# EAGLE schematic untitled (EAGLE 9.0.1)
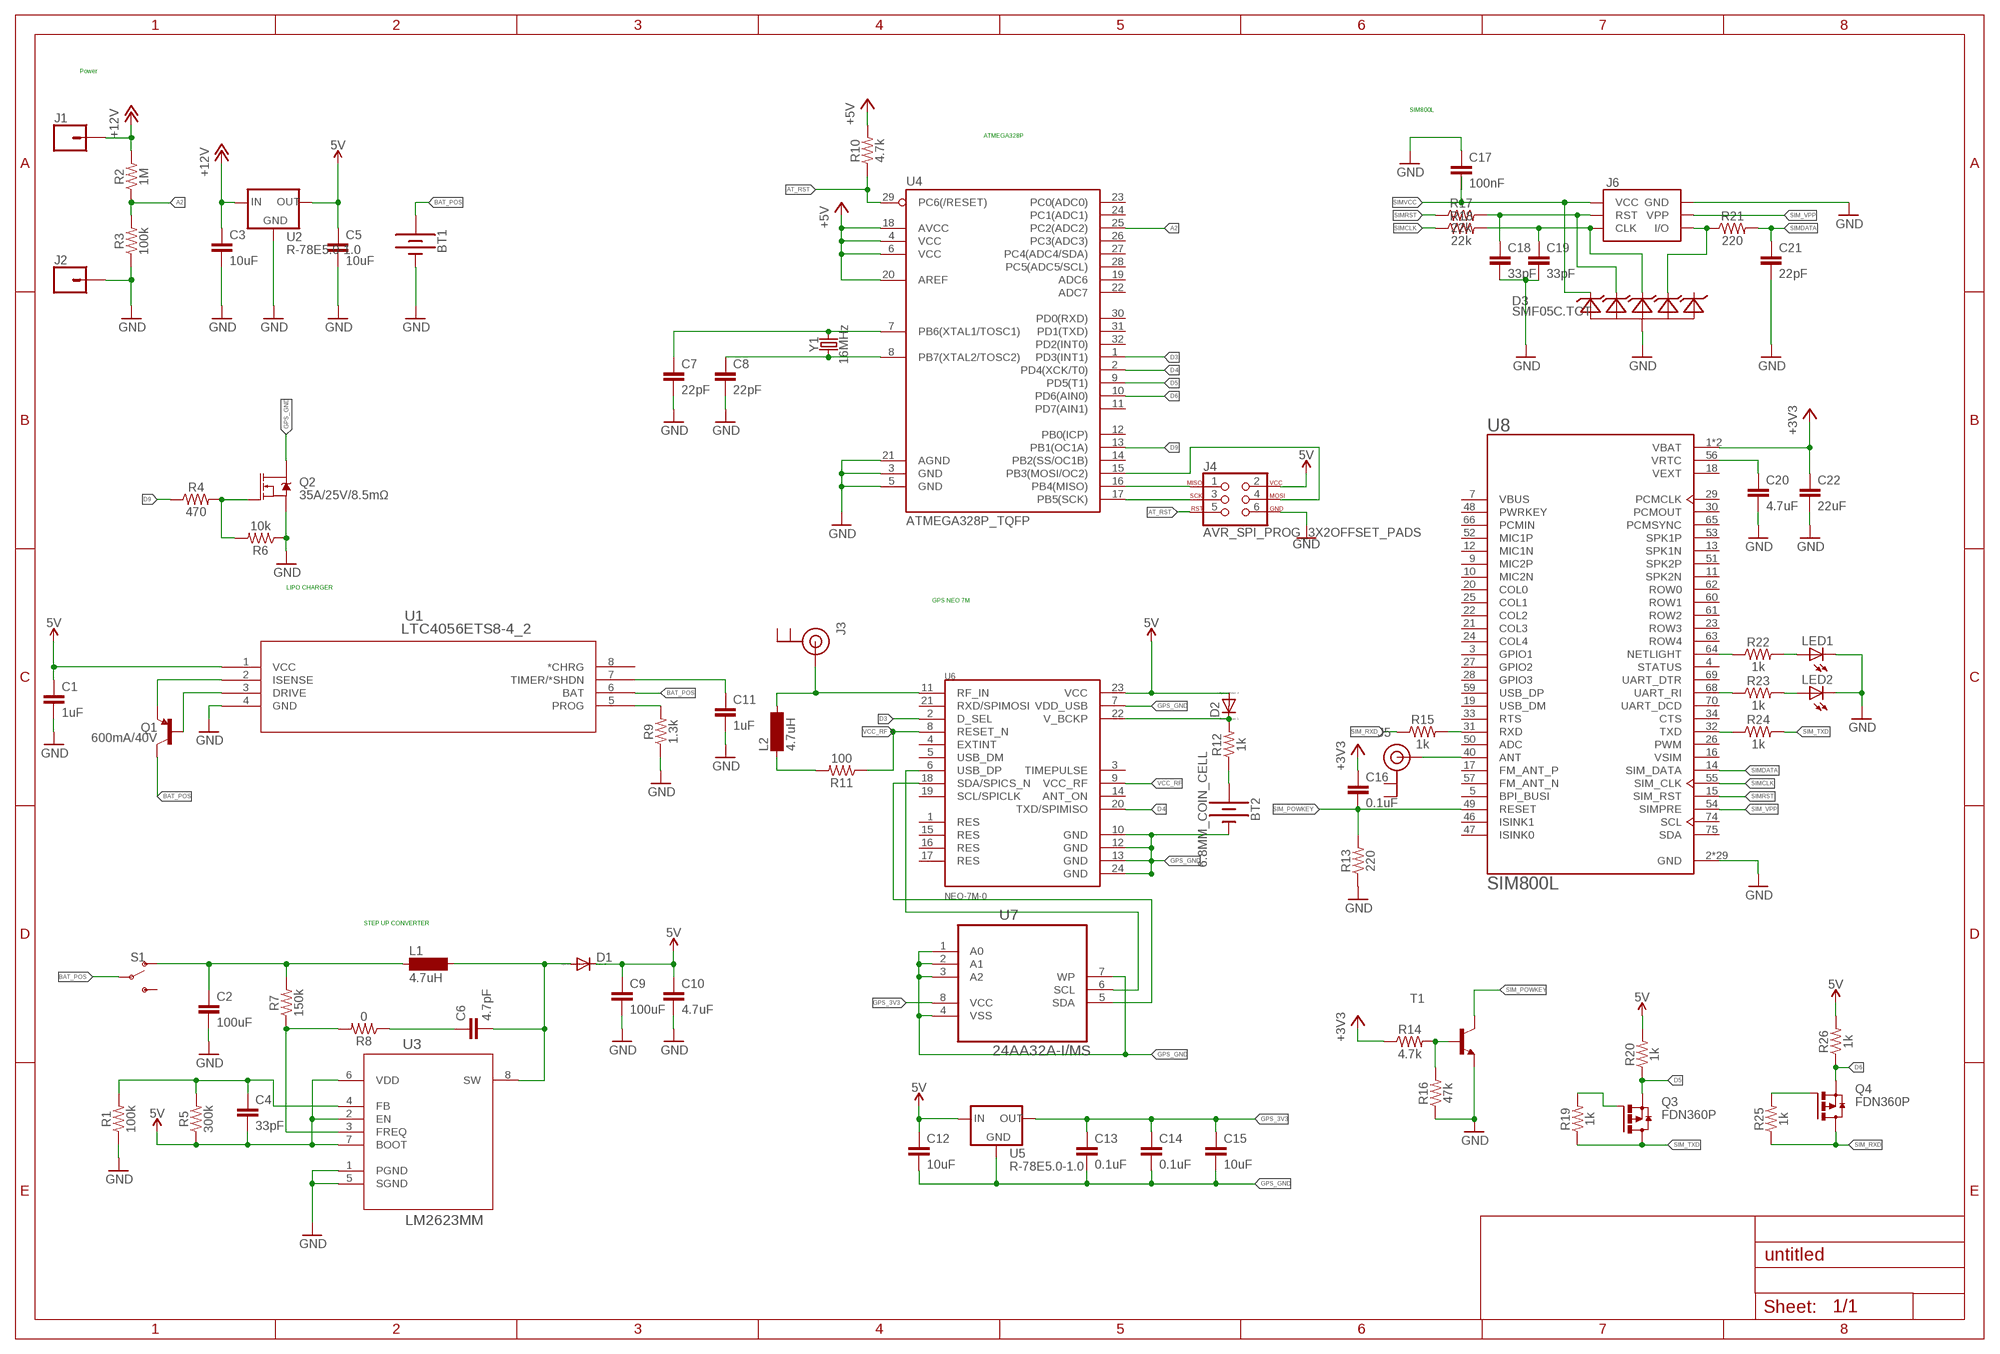
[diagram p0: schematic, sheet 1]

## Parts
BT1  BATTERY-18650  [BATTERY_18650-HOLDER]
BT2  6.8MM_COIN_CELL  BATTERY-6.8MM_SMD  [BATTCON-6.8MM]
C1  1uF  0.33UF/330NF-0805-50V-10%  [0805]
C2  100uF  0.33UF/330NF-0805-50V-10%  [0805]
C3  10uF  0.33UF/330NF-0805-50V-10%  [0805]
C4  33pF  0.33UF/330NF-0805-50V-10%  [0805]
C5  10uF  0.33UF/330NF-0805-50V-10%  [0805]
C6  4.7pF  0.33UF/330NF-0805-50V-10%  [0805]
C7  22pF  10NF-0603-50V-10%  [0603]
C8  22pF  10NF-0603-50V-10%  [0603]
C9  100uF  0.33UF/330NF-0805-50V-10%  [0805]
C10  4.7uF  0.33UF/330NF-0805-50V-10%  [0805]
C11  1uF  0.33UF/330NF-0805-50V-10%  [0805]
C12  10uF  0.33UF/330NF-0805-50V-10%  [0805]
C13  0.1uF  0.33UF/330NF-0805-50V-10%  [0805]
C14  0.1uF  0.33UF/330NF-0805-50V-10%  [0805]
C15  10uF  0.33UF/330NF-0805-50V-10%  [0805]
C16  0.1uF  0.33UF/330NF-0805-50V-10%  [0805]
C17  100nF  0.33UF/330NF-0805-50V-10%  [0805]
C18  33pF  0.33UF/330NF-0805-50V-10%  [0805]
C19  33pF  0.33UF/330NF-0805-50V-10%  [0805]
C20  4.7uF  0.33UF/330NF-0805-50V-10%  [0805]
C21  22pF  0.33UF/330NF-0805-50V-10%  [0805]
C22  22uF  0.33UF/330NF-0805-50V-10%  [0805]
D1  DIODE-DO-214AC  [DO-214AC]
D2  DIODE_E-  [DIODE_SMB]
D3  SMF05C.TCT  [SC70-6]
J1  CONN_01PTH_2MM  [1X01_2MM]
J2  CONN_01PTH_2MM  [1X01_2MM]
J3  U.FL  [U.FL]
J4  AVR_SPI_PROG_3X2OFFSET_PADS  [2X3_OFFSET]
J5  U.FL  [U.FL]
J6  SIMHOLDERSIM  [SIMHOLDER]
L1  4.7uH  MS42  [MS42]
L2  4.7uH  MS42  [MS42]
LED1  LEDCHIPLED_0805  [CHIPLED_0805]
LED2  LEDCHIPLED_0805  [CHIPLED_0805]
Q1  600mA/40V  TRANS_PNP-MMBT4403  [SOT23-3]
Q2  35A/25V/8.5mΩ  MOSFET-NCH-FDD8780  [DPAK]
Q3  FDN360P  [SUPER-SOT3]
Q4  FDN360P  [SUPER-SOT3]
R1  100k  RESISTOR0805  [0805]
R2  1M  RESISTOR0805  [0805]
R3  100k  RESISTOR0805  [0805]
R4  470  RESISTOR0805  [0805]
R5  300k  RESISTOR0805  [0805]
R6  10k  RESISTOR0805  [0805]
R7  150k  RESISTOR0805  [0805]
R8  0  RESISTOR0805  [0805]
R9  1.3k  RESISTOR0805  [0805]
R10  4.7k  RESISTOR0805  [0805]
R11  100  RESISTOR0805  [0805]
R12  1k  RESISTOR0805  [0805]
R13  220  0.22OHM-0805-1/4W-1%  [0805]
R14  4.7k  RESISTOR0805  [0805]
R15  1k  0.3OHM-0805-1/8W-1%  [0805]
R16  47k  RESISTOR0805  [0805]
R17  22k  0.22OHM-0805-1/4W-1%  [0805]
R18  22k  0.22OHM-0805-1/4W-1%  [0805]
R19  1k  RESISTOR0805  [0805]
R20  1k  RESISTOR0805  [0805]
R21  220  0.22OHM-0805-1/4W-1%  [0805]
R22  1k  0.3OHM-0805-1/8W-1%  [0805]
R23  1k  0.3OHM-0805-1/8W-1%  [0805]
R24  1k  0.3OHM-0805-1/8W-1%  [0805]
R25  1k  RESISTOR0805  [0805]
R26  1k  RESISTOR0805  [0805]
S1  SWITCH-SPDT-PTH-11.6X4.0MM-KIT  [SWITCH_SPDT_PTH_11.6X4.0MM_KIT]
T1  -NPN-SC59-BEC  [SC59-BEC]
U1  LTC4056ETS8-4_2  [SOT-23_TS]
U2  R-78E5.0-1.0  [DC-DC_CONVERTER_78XX]
U3  LM2623MM  [SOP65P490X110-8N]
U4  ATMEGA328P_TQFP  [TQFP32-08]
U5  R-78E5.0-1.0  [DC-DC_CONVERTER_78XX]
U6  NEO-7M-0  [XCVR_NEO-7M-0]
U7  24AA32A-I/MS  [SOP65P490X110-8N]
U8  SIM800L  [MODULE_SIM800L]
Y1  16MHz  CRYSTAL-16MHZSMD-5X3.2  [CRYSTAL-SMD-5X3.2-4PAD]

## Nets
5V: C1.1 C4.2 C5.1 C9.1 C10.1 C12.1 D1.C D2.A(C) J4.2 R5.1 R20.2 R26.2 U1.1(VCC) U2.VOUT(OUT) U3.2(EN) U3.6(VDD) U3.7(BOOT) U5.VIN(IN) U6.23(VCC)
+3V3: C16.1 C22.1 R14.1 U8.1(VBAT) U8.42(VBAT)
+5V: R10.2 U4.4(VCC) U4.6(VCC) U4.18(AVCC) U4.20(AREF)
+12V: C3.1 J1.1 R2.2 U2.VIN(IN)
A2: R2.1 R3.2 U4.25(PC2(ADC2))
AT_RST: J4.5 R10.1 U4.29(PC6(/RESET))
BAT_POS: BT1.PWR@1(+) Q1.3(C) S1.2(P) U1.6(BAT)
D3: U4.1(PD3(INT1)) U6.2(D_SEL)
D4: U4.2(PD4(XCK/T0)) U6.20(TXD/SPIMISO)
D5: Q3.2(S) R20.1 U4.9(PD5(T1))
D6: Q4.2(S) R26.1 U4.10(PD6(AIN0))
D9: R4.1 U4.13(PB1(OC1A))
GND: BT1.GND@1(-) C1.2 C2.2 C3.2 C5.2 C7.2 C8.2 C9.2 C10.2 C11.2 C17.1 C18.2 C19.2 C20.2 C21.2 C22.2 D3.2(A) J2.1 J4.6 J6.C5(GND) LED1.C LED2.C Q2.3(S) R1.1 R3.1 R6.1 R9.1 R13.1 R16.1 T1.E U1.4(GND) U2.GND U3.1(PGND) U3.5(SGND) U4.3(GND) U4.5(GND) U4.21(AGND) U8.2(GND) U8.6(GND) U8.8(GND) U8.35(GND) U8.37(GND) U8.38(GND) U8.39(GND) U8.41(GND) U8.43(GND) U8.44(GND) U8.45(GND) U8.58(GND) U8.67(GND) U8.71(GND) U8.72(GND) U8.73(GND) U8.76(GND) U8.77(GND) U8.78(GND) U8.79(GND) U8.80(GND) U8.81(GND) U8.82(GND) U8.83(GND) U8.84(GND) U8.85(GND) U8.86(GND) U8.87(GND) U8.88(GND)
GPS_3V3: C13.1 C14.1 C15.1 U5.VOUT(OUT) U7.8(VCC)
GPS_GND: BT2.- C12.2 C13.2 C14.2 C15.2 Q2.4(D) U5.GND U6.7(VDD_USB) U6.10(GND) U6.12(GND) U6.13(GND) U6.24(GND) U7.1(A0) U7.2(A1) U7.3(A2) U7.4(VSS) U7.7(WP)
N$1: R14.2 R16.2 T1.B
N$2: C7.1 U4.7(PB6(XTAL1/TOSC1)) Y1.3
N$3: C8.1 U4.8(PB7(XTAL2/TOSC2)) Y1.1
N$4: D3.5(C4) J6.C7(I/O) R21.1
N$5: C18.1 D3.3(C2) J6.C2(RST) R17.2
N$6: C19.1 D3.4(C3) J6.C3(CLK) R18.2
N$7: R15.2 U8.31(RXD)
N$8: R24.1 U8.32(TXD)
N$9: J5.FEED(SIGNAL) U8.40(ANT)
N$10: C20.1 U8.56(VRTC)
N$11: R23.1 U8.68(UART_RI)
N$12: R22.1 U8.64(NETLIGHT)
N$13: LED1.A R22.2
N$14: LED2.A R23.2
N$15: R9.2 U1.5(PROG)
N$16: Q4.1(G) R25.2
N$17: Q3.1(G) R19.2
N$18: Q1.2(E) U1.2(ISENSE)
N$19: Q1.1(B) U1.3(DRIVE)
N$20: C11.1 U1.7(TIMER/*SHDN)
N$21: C6.2 D1.A L1.2 U3.8(SW)
N$22: C2.1 L1.1 R7.2 S1.1(O)
N$23: J3.FEED(SIGNAL) L2.2 U6.11(RF_IN)
N$24: R7.1 R8.2 U3.3(FREQ)
N$25: C6.1 R8.1
N$26: L2.1 R11.2
N$27: C4.1 R1.2 R5.2 U3.4(FB)
N$28: U6.18(SDA/SPICS_N) U7.5(SDA)
N$29: U6.6(USB_DP) U7.6(SCL)
N$30: BT2.+ R12.1
N$31: D2.C(A) R12.2 U6.22(V_BCKP)
N$34: J4.1 U4.16(PB4(MISO))
N$35: J4.3 U4.17(PB5(SCK))
N$36: Q2.1(G) R4.2 R6.2
N$37: J4.4 U4.15(PB3(MOSI/OC2))
SIM_POWKEY: C16.2 R13.2 T1.C U8.49(RESET)
SIM_RXD: Q4.3(D) R15.1 R25.1
SIM_TXD: Q3.3(D) R19.1 R24.2
SIM_VPP: J6.C6(VPP) U8.54(SIMPRE)
SIMCLK: R18.1 U8.55(SIM_CLK)
SIMDATA: C21.1 R21.2 U8.14(SIM_DATA)
SIMRST: R17.1 U8.15(SIM_RST)
SIMVCC: C17.2 D3.1(C1) J6.C1(VCC)
VCC_RF: R11.1 U6.8(RESET_N) U6.9(VCC_RF)
Unconnected: D3.6(C5) J3.1(GND) J3.2(GND) J5.1(GND) J5.2(GND) S1.3(S) U1.8(*CHRG) U4.11(PD7(AIN1)) U4.12(PB0(ICP)) U4.14(PB2(SS/OC1B)) U4.19(ADC6) U4.22(ADC7) U4.23(PC0(ADC0)) U4.24(PC1(ADC1)) U4.26(PC3(ADC3)) U4.27(PC4(ADC4/SDA)) U4.28(PC5(ADC5/SCL)) U4.30(PD0(RXD)) U4.31(PD1(TXD)) U4.32(PD2(INT0)) U6.1(RES) U6.3(TIMEPULSE) U6.4(EXTINT) U6.5(USB_DM) U6.14(ANT_ON) U6.15(RES) U6.16(RES) U6.17(RES) U6.19(SCL/SPICLK) U6.21(RXD/SPIMOSI) U8.3(GPIO1) U8.4(STATUS) U8.5(BPI_BUSI) U8.7(VBUS) U8.9(MIC2P) U8.10(MIC2N) U8.11(SPK2N) U8.12(MIC1N) U8.13(SPK1N) U8.16(VSIM) U8.17(FM_ANT_P) U8.19(USB_DM) U8.20(COL0) U8.21(COL3) U8.22(COL2) U8.23(ROW3) U8.24(COL4) U8.25(COL1) U8.26(PWM) U8.27(GPIO2) U8.28(GPIO3) U8.29(PCMCLK) U8.30(PCMOUT) U8.33(RTS) U8.34(CTS) U8.46(ISINK1) U8.47(ISINK0) U8.48(PWRKEY) U8.50(ADC) U8.51(SPK2P) U8.52(MIC1P) U8.53(SPK1P) U8.57(FM_ANT_N) U8.59(USB_DP) U8.60(ROW1) U8.61(ROW2) U8.62(ROW0) U8.63(ROW4) U8.65(PCMSYNC) U8.66(PCMIN) U8.69(UART_DTR) U8.70(UART_DCD) U8.74(SCL) U8.75(SDA)

## Notes on the sheet
- Power
- SIM800L
- ATMEGA328P
- LIPO CHARGER
- GPS NEO 7M
- STEP UP CONVERTER

## Power pins joined to a net without a drawn wire
VEXT: U8.18(VEXT)

## Library data of the parts
BT1 = SparkFun-Batteries:BATTERY: Battery - Single Cell A variety of battery chemistries, sizes, and footprints. Device List: 20MM_PTH - Coin Cell Battery Holder - 20mm (PTH) <https://www.sparkfun.com/products/783> 6.8MM_PTH - Coin Cell Battery Holder - 6.8MM(SMD) <https://www.digikey.com/product-detail/en/seiko-instruments/MS621FE-FL11E/728-1057-ND/1889208?WT.srch=1&gclid=CNOQ5a6LzdQCFZS2wAodXCkE0g> 12MM_SMD - Coin Cell Battery Holder - 12mm (SMD) <https://www.sparkfun.com/products/10592> 12MM_PTH - Coin Cell Battery Holder - 12mm (PTH) <https://www.sparkfun.com/products/7948> 20MM_SMD - 20mm Coin Cell Battery Holder (SMD) (2 legs) Used on the Big Time Watch Kit <https://www.sparkfun.com/products/11734> 20MM_SMD_4LEGS - Coin Cell Battery Holder - 20mm (SMD) <https://www.sparkfun.com/products/11892> 20MM_SMD_4LEGS_OVERPASTE - Coin Cell Battery Holder - 20mm (SMD) <https://www.sparkfun.com/products/11892> (Over-paste on the legs) 24.5MM_PTH - Coin Cell Battery Holder - 24.5mm (PTH) <https://www.sparkfun.com/products/8863> 9V - 9V Battery Holder - PC Mount Used on the SparkFun SparkPunk Sound Kit <https://www.sparkfun.com/products/11177> and SparkFun SparkPunk Sequencer Kit <https://www.sparkfun.com/products/12707> 18650 - Battery Holder - 18650 (PTH) <https://www.sparkfun.com/products/13113> AA - Battery Holder - 1xAA (PTH) <https://www.sparkfun.com/products/7949> AAA - Battery Holder - 1xAAA (PTH) <https://www.sparkfun.com/products/12718> AA_KIT - Battery Holder - 1xAA (PTH) <https://www.sparkfun.com/products/7949> Special kit package - pads only have exposed copper on one side of the board. AAA_KIT - Battery Holder - 1xAAA (PTH) <https://www.sparkfun.com/products/12718> Special kit package - pads only have exposed copper on one side of the board.; PROD_ID: BATT-12327; SF_SKU: PRT-13113
BT2 = SparkFun-Batteries:BATTERY: Battery - Single Cell A variety of battery chemistries, sizes, and footprints. Device List: 20MM_PTH - Coin Cell Battery Holder - 20mm (PTH) <https://www.sparkfun.com/products/783> 6.8MM_PTH - Coin Cell Battery Holder - 6.8MM(SMD) <https://www.digikey.com/product-detail/en/seiko-instruments/MS621FE-FL11E/728-1057-ND/1889208?WT.srch=1&gclid=CNOQ5a6LzdQCFZS2wAodXCkE0g> 12MM_SMD - Coin Cell Battery Holder - 12mm (SMD) <https://www.sparkfun.com/products/10592> 12MM_PTH - Coin Cell Battery Holder - 12mm (PTH) <https://www.sparkfun.com/products/7948> 20MM_SMD - 20mm Coin Cell Battery Holder (SMD) (2 legs) Used on the Big Time Watch Kit <https://www.sparkfun.com/products/11734> 20MM_SMD_4LEGS - Coin Cell Battery Holder - 20mm (SMD) <https://www.sparkfun.com/products/11892> 20MM_SMD_4LEGS_OVERPASTE - Coin Cell Battery Holder - 20mm (SMD) <https://www.sparkfun.com/products/11892> (Over-paste on the legs) 24.5MM_PTH - Coin Cell Battery Holder - 24.5mm (PTH) <https://www.sparkfun.com/products/8863> 9V - 9V Battery Holder - PC Mount Used on the SparkFun SparkPunk Sound Kit <https://www.sparkfun.com/products/11177> and SparkFun SparkPunk Sequencer Kit <https://www.sparkfun.com/products/12707> 18650 - Battery Holder - 18650 (PTH) <https://www.sparkfun.com/products/13113> AA - Battery Holder - 1xAA (PTH) <https://www.sparkfun.com/products/7949> AAA - Battery Holder - 1xAAA (PTH) <https://www.sparkfun.com/products/12718> AA_KIT - Battery Holder - 1xAA (PTH) <https://www.sparkfun.com/products/7949> Special kit package - pads only have exposed copper on one side of the board. AAA_KIT - Battery Holder - 1xAAA (PTH) <https://www.sparkfun.com/products/12718> Special kit package - pads only have exposed copper on one side of the board.; PROD_ID: BATT-13734
C1-C6 C9-C22 = SparkFun-Capacitors:0.33UF/330NF: 0.33µF/330nF ceramic capacitors A capacitor is a passive two-terminal electrical component used to store electrical energy temporarily in an electric field.; PROD_ID: CAP-08469; VALUE: 0.33µF
C7 C8 = SparkFun-Capacitors:10NF: 0.01uF/10nF/10,000pF ceramic capacitors A capacitor is a passive two-terminal electrical component used to store electrical energy temporarily in an electric field. CAP-09321; PROD_ID: CAP-00867; VALUE: 10nF
D1 = diode:DIODE-: DIODE
D2 = eagle-ltspice:DIODE_E-: Schottky Diode; SPICEMODEL: diode; SPICEPREFIX: D
D3 = SMF05C.TCT:SMF05C.TCT; AVAILABILITY: Unavailable; MF: Semtech; MP: SMF05C.TCT; PACKAGE: SOT-363 Diodes Inc.; PRICE: None
J1 J2 = SparkFun-Connectors:CONN_01: Single connection point. Often used as Generic Header-pin footprint for 0.1 inch spaced/style header connections On any of the 0.1 inch spaced packages, you can populate with these: Break Away Headers - Straight <https://www.sparkfun.com/products/116> (PRT-00116) Break Away Male Headers - Right Angle <https://www.sparkfun.com/products/553> (PRT-00553) Female Headers <https://www.sparkfun.com/products/115> (PRT-00115) Break Away Headers - Machine Pin <https://www.sparkfun.com/products/117> (PRT-00117) Break Away Female Headers - Swiss Machine Pin <https://www.sparkfun.com/products/743> (PRT-00743) This device is also useful as a general connection point to wire up your design to another part of your project. Our various solder wires solder well into these plated through hole pads. Hook-Up Wire - Assortment (Stranded, 22 AWG) <https://www.sparkfun.com/products/11375> (PRT-11375) Hook-Up Wire - Assortment (Solid Core, 22 AWG) <https://www.sparkfun.com/products/11367> (PRT-11367) View the entire wire category on our website here <https://www.sparkfun.com/categories/141> Special notes: SMTSO-256-ET is a "flush mount" nut for a 4-40 screw. We mostly use this on specialty testbeds; it is a nice way to connect hardware to your PCB at an adjustable hieght. Also note, the SNAP packages are for using a snappable style connector. We sell a baggie of snaps and they are also used on two LilyPad designs: Snap Assortment - 30 pack (male and female) <https://www.sparkfun.com/products/11347> (DEV-11347) LilyPad Arduino SimpleSnap <https://www.sparkfun.com/products/10941> (DEV-10941) LilyPad SimpleSnap Protoboard <https://www.sparkfun.com/products/10940> (DEV-10940)
J3 J5 = SparkFun-Connectors:U.FL: SMD Antenna Connector - U.FL 2mm height, 3.0mm x 3.0mm receptacle size. SparkFun Products: SparkFun WiFi Shield - ESP8266 <https://www.sparkfun.com/products/13287> SparkFun ESP8266 Thing <https://www.sparkfun.com/products/13231> SparkFun MiniGen - Pro Mini Signal Generator Shield <https://www.sparkfun.com/products/11420>; PROD_ID: CONN-09193; SF_ID: WRL-09144
J4 = SparkFun-Connectors:AVR_SPI_PROG_3X2: AVR ISP 6 Pin This is the reduced ISP connector for AVR programming. Common on Arduino. This footprint will take up less PCB space and can be used with a 10-pin to 6-pin adapter such as SKU: BOB-08508 **Special note about "TEST_POINT" package. The stop mask is on the top side, so if you want your programming test points to be on the bottom of your board, make sure to place this package on the bottom side of the board. This also ensure that the orientation to program from the bottom side will be correct. SparkFun Products: SparkFun ISP Pogo Adapter <https://www.sparkfun.com/products/11591> - NS Tiny AVR Programmer <https://www.sparkfun.com/products/11801> -PTH
J6 = SparkFun-Connectors:SIMHOLDER: SIM Cellular Card Socket SMT 6 pin standard connection. SparkFun Products: SIM Socket <https://www.sparkfun.com/products/548> SparkFun Cellular Shield - MG2639 <https://www.sparkfun.com/products/13120> SparkFun SIM Card Socket Breakout <https://www.sparkfun.com/products/573>; PROD_ID: CONN-08536; SF_ID: PRT-00548
L1 L2 = inductor-neosid:MS42: INDUCTOR SMD inductor; OC_FARNELL: unknown; OC_NEWARK: unknown
LED1 LED2 = led:LED: LED OSRAM: - CHIPLED LG R971, LG N971, LY N971, LG Q971, LY Q971, LO R971, LY R971 LH N974, LH R974 LS Q976, LO Q976, LY Q976 LO Q996 - Hyper CHIPLED LW Q18S LB Q993, LB Q99A, LB R99A - SideLED LS A670, LO A670, LY A670, LG A670, LP A670 LB A673, LV A673, LT A673, LW A673 LH A674 LY A675 LS A676, LA A676, LO A676, LY A676, LW A676 LS A679, LY A679, LG A679 - Hyper Micro SIDELED® LS Y876, LA Y876, LO Y876, LY Y876 LT Y87S - SmartLED LW L88C, LW L88S LB L89C, LB L89S, LG L890 LS L89K, LO L89K, LY L89K LS L896, LA L896, LO L896, LY L896 - TOPLED LS T670, LO T670, LY T670, LG T670, LP T670 LSG T670, LSP T670, LSY T670, LOP T670, LYG T670 LG T671, LOG T671, LSG T671 LB T673, LV T673, LT T673, LW T673 LH T674 LS T676, LA T676, LO T676, LY T676, LB T676, LH T676, LSB T676, LW T676 LB T67C, LV T67C, LT T67C, LS T67K, LO T67K, LY T67K, LW E67C LS E67B, LA E67B, LO E67B, LY E67B, LB E67C, LV E67C, LT E67C LW T67C LS T679, LY T679, LG T679 LS T770, LO T770, LY T770, LG T770, LP T770 LB T773, LV T773, LT T773, LW T773 LH T774 LS E675, LA E675, LY E675, LS T675 LS T776, LA T776, LO T776, LY T776, LB T776 LHGB T686 LT T68C, LB T68C - Hyper Mini TOPLED® LB M676 - Mini TOPLED Santana® LG M470 LS M47K, LO M47K, LY M47K Source: http://www.osram.convergy.de LUXEON: - LUMILED® LXK2-PW12-R00, LXK2-PW12-S00, LXK2-PW14-U00, LXK2-PW14-V00 LXK2-PM12-R00, LXK2-PM12-S00, LXK2-PM14-U00 LXK2-PE12-Q00, LXK2-PE12-R00, LXK2-PE12-S00, LXK2-PE14-T00, LXK2-PE14-U00 LXK2-PB12-K00, LXK2-PB12-L00, LXK2-PB12-M00, LXK2-PB14-N00, LXK2-PB14-P00, LXK2-PB14-Q00 LXK2-PR12-L00, LXK2-PR12-M00, LXK2-PR14-Q00, LXK2-PR14-R00 LXK2-PD12-Q00, LXK2-PD12-R00, LXK2-PD12-S00 LXK2-PH12-R00, LXK2-PH12-S00 LXK2-PL12-P00, LXK2-PL12-Q00, LXK2-PL12-R00 Source: www.luxeon.com KINGBRIGHT: KA-3528ASYC Source: www.kingbright.com
Q1 = SparkFun-DiscreteSemi:TRANS_PNP: PNP transistor Current controlled devices typically used to amplify current or used as a switch. SparkFun Products: SparkFun Serial Enabled 16x2 LCD - Red on Black <https://www.sparkfun.com/products/9068> SparkFun Logomatic <https://www.sparkfun.com/products/12772>; PROD_ID: TRANS-09245
Q2 = SparkFun-DiscreteSemi:MOSFET-NCH: N-channel MOSFETs Voltage controlled devices that allow control of high current outputs. SparkFun Products: SparkFun OpenScale <https://www.sparkfun.com/products/13261> SparkFun Digital Sandbox <https://www.sparkfun.com/products/12651> SparkFun Monster Moto Shield <https://www.sparkfun.com/products/10182> SparkFun MOSFET Power Controller <https://www.sparkfun.com/products/11214>; PROD_ID: TRANS-09984
Q3 Q4 = transistor-power:FDN360P: Single P-Channel, PowerTrench (R) MOSFET Source: http://www.fairchildsemi.com/ds/FD/FDN360P.pdf
R1-R12 R14 R16 R19 R20 R25 R26 = SparkFun-Resistors:RESISTOR: Generic Resistor Package
R13 R17 R18 R21 = SparkFun-Resistors:0.22OHM: 0.22Ω resistor A resistor is a passive two-terminal electrical component that implements electrical resistance as a circuit element. Resistors act to reduce current flow, and, at the same time, act to lower voltage levels within circuits. - Wikipedia; PROD_ID: RES-09883; VALUE: 0.22
R15 R22-R24 = SparkFun-Resistors:0.3OHM: 0.3Ω resistor A resistor is a passive two-terminal electrical component that implements electrical resistance as a circuit element. Resistors act to reduce current flow, and, at the same time, act to lower voltage levels within circuits. - Wikipedia; PROD_ID: RES-11622; VALUE: 0.3
S1 = SparkFun-Switches:SWITCH-SPDT: Single Pole, Double Throw (SPDT) Switch Single-pole, double-throw (SPDT) switch. Variant Overview SMD-AYZ0202 Surface Mount DPDT Switch <https://www.sparkfun.com/products/597> (COM-00597) Used on e.g. LilyPad Arduino USB - ATmega32U4 Board <https://www.sparkfun.com/products/12049> PTH-11.6X4.0MM SPDT Mini Power Switch <https://www.sparkfun.com/products/102> (COM-00102) Used on e.g. SparkFun Simon Says - Through-Hole Soldering Kit <https://www.sparkfun.com/products/10547> (KIT-10547) PTH-11.6X4.0MM-KIT KIT version of SPDT Mini Power Switch - Simplifies soldering by removing tStop of switch pins - only one side can be soldered. PTH-11.6X4.0MM-LOCK LOCK version of SPDT Mini Power Switch - Offset pins hold switch in place for easier soldering. SMD-RIGHT-ANGLE Surface Mount Right Angle Switch <https://www.sparkfun.com/products/10860> (COM-10860) Used on e.g. SparkFun ESP8266 Thing <https://www.sparkfun.com/products/13231>; PROD_ID: SWCH-08261; SF_SKU: COM-00102
T1 = DC_LOAD_AU:*-NPN-: NPN Transistror BF959 corrected 2008.03.06
U1 = LTC4056ETS8-4_2:LTC4056ETS8-4_2; AVAILABILITY: Unavailable; DESCRIPTION: LTC4056-4.2 - Linear Li-Ion Charger with Termination in ThinSOT; MF: Linear Technology; MP: LTC4056ETS8-4.2; PACKAGE: None; PRICE: None
U2 U5 = SparkFun-IC-Power:R-78E5.0-1.0: Recom Power 5V 1A DC/DC Converter The Recom R-78E5.0-X.X is a compact DC/DC converter module that is a pin for pin drop-in replacement for the LM7805 linear voltage regulator. Specifications: Input Range: 7-28V Output Voltage: 5V Output Current: 1A Max Efficiency: 91% Datasheet <https://www.recom-power.com/pdf/Innoline/R-78Exx-1.0.pdf>; PROD_ID: COM-13655
U3 = LM2623MM:LM2623MM: DC/DC Boost Converter; AVAILABILITY: Good; DESCRIPTION: General Purpose, Gated Oscillator Based, DC/DC Boost Converter 8-VSSOP -40 to 85; MF: Texas Instruments; MP: LM2623MM/NOPB; PACKAGE: MSOP-8 Texas Instruments; PRICE: 1.01 USD
U4 = SparkFun-IC-Microcontroller:ATMEGA328P_TQFP: Popular 328P in QFP Storefront component: ATmega328 - TQFP <https://www.sparkfun.com/products/13448> (COM-13448) Datasheet <http://www.sparkfun.com/datasheets/Components/SMD/ATMega328.pdf> SparkFun Products SparkFun RedBoard - Programmed with Arduino <https://www.sparkfun.com/products/12757> (DEV-12757) Arduino Pro Mini 328 - 5V/16MHz <https://www.sparkfun.com/products/11113> (DEV-11113) Arduino Pro Mini 328 - 3.3V/8MHz <https://www.sparkfun.com/products/11114> (DEV-11114) SparkFun OpenLog <https://www.sparkfun.com/products/13712> (DEV-13712) SparkFun MicroView - OLED Arduino Module <https://www.sparkfun.com/products/12923> (DEV-12923) SparkFun Digital Sandbox <https://www.sparkfun.com/products/12651> (DEV-12651) SparkFun PicoBoard <https://www.sparkfun.com/products/11888> (WIG-11888) Arduino Fio <https://www.sparkfun.com/products/10116> (DEV-10116) LilyPad Arduino 328 Main Board <https://www.sparkfun.com/products/13342> (DEV-13342) SparkFun RedStick <https://www.sparkfun.com/products/13741> (DEV-13741) LilyPad MP3 <https://www.sparkfun.com/products/11013> (DEV-11013) LilyPad Arduino SimpleSnap <https://www.sparkfun.com/products/10941> (DEV-10941) SparkFun Stepoko <https://www.sparkfun.com/products/13899> (ROB-13899) SparkFun Geiger Counter <https://www.sparkfun.com/products/11345> (SEN-11345) SparkFun EL Sequencer <https://www.sparkfun.com/products/12781> (COM-12781) Arduino Pro 328 - 5V/16MHz <https://www.sparkfun.com/products/10915> (DEV-10915) CryptoCape <https://www.sparkfun.com/products/12773> (DEV-12773) SparkFun IR Thermometer Evaluation Board - MLX90614 <https://www.sparkfun.com/products/10740> (SEN-10740) SparkFun RedBot Mainboard <https://www.sparkfun.com/products/12097> (ROB-12097) Arduino Pro 328 - 3.3V/8MHz <https://www.sparkfun.com/products/10914> (DEV-10914) SparkFun Block for Intel® Edison - Arduino <https://www.sparkfun.com/products/13036> (DEV-13036) SparkFun Simon Says - Surface Mount Soldering Kit <https://www.sparkfun.com/products/10935> (KIT-10935) SparkFun 7-Segment Serial Display - Red <https://www.sparkfun.com/products/11441> (COM-11441) SparkFun 7-Segment Serial Display - White <https://www.sparkfun.com/products/11629> (COM-11629) SparkFun 7-Segment Serial Display - Yellow <https://www.sparkfun.com/products/11443> (COM-11443) SparkFun 7-Segment Serial Display - Kelly Green <https://www.sparkfun.com/products/11440> (COM-11440) SparkFun 7-Segment Serial Display - Blue <https://www.sparkfun.com/products/11442> (COM-11442) SparkFun OpenSegment Serial Display - 20mm (Blue) <https://www.sparkfun.com/products/11647> (COM-11647) SparkFun OpenSegment Serial Display - 20mm (Green) <https://www.sparkfun.com/products/11646> (COM-11646) SparkFun OpenSegment Serial Display - 20mm (White) <https://www.sparkfun.com/products/11648> (COM-11648) SparkFun OpenSegment Serial Display - 20mm (Red) <https://www.sparkfun.com/products/11644> (COM-11644) SparkFun OpenSegment Serial Display - 20mm (Yellow) <https://www.sparkfun.com/products/11645> (COM-11645) SparkFun OpenSegment Shield <https://www.sparkfun.com/products/13190> (DEV-13190); PROD_ID: IC-09069
U6 = NEO-7M-0:NEO-7M-0; AVAILABILITY: Unavailable; DESCRIPTION: u-blox 7 GPS/GNSS Module*Crystal*ROM*12x16mm; MF: u-blox; MP: NEO-7M-0; PACKAGE: None; PRICE: None
U7 = 24AA32A-I_MS:24AA32A-I/MS: IC EEPROM 32KBIT 400KHZ; AVAILABILITY: Good; DESCRIPTION: 24AA32A Series 32 Kbit _4K X 8_ 5.5 V Surface Mount I2C Serial EEPROM - MSOP-8; MF: Microchip; MP: 24AA32A-I/MS; PACKAGE: MSOP-8 Microchip; PRICE: 0.33 USD
U8 = SIM800L:SIM800L: SIM8000L. Quad-band GSM/GPRS Module; AVAILABILITY: Unavailable; MF: Simcom; MP: SIM800L; PACKAGE: None; PRICE: None
Y1 = SparkFun-Clocks:CRYSTAL-16MHZ: 16MHz Crystal Digikey Example <http://www.digikey.com/product-search/en?keywords=535-9122-1-ND> Frequency: 16MHz Frequency Stability: ±50ppm Frequency Tolerance: ±20ppm Load Capacitance: 18pF SparkFun Products: Pro Micro -5V/16MHz <https://www.sparkfun.com/products/12640> SparkFun Serial Enabled LCD Kit <https://www.sparkfun.com/products/10097>; PROD_ID: XTAL-08218; SF_ID: COM-00094